# EAGLE design PR9013 (EAGLE 6.6.0)
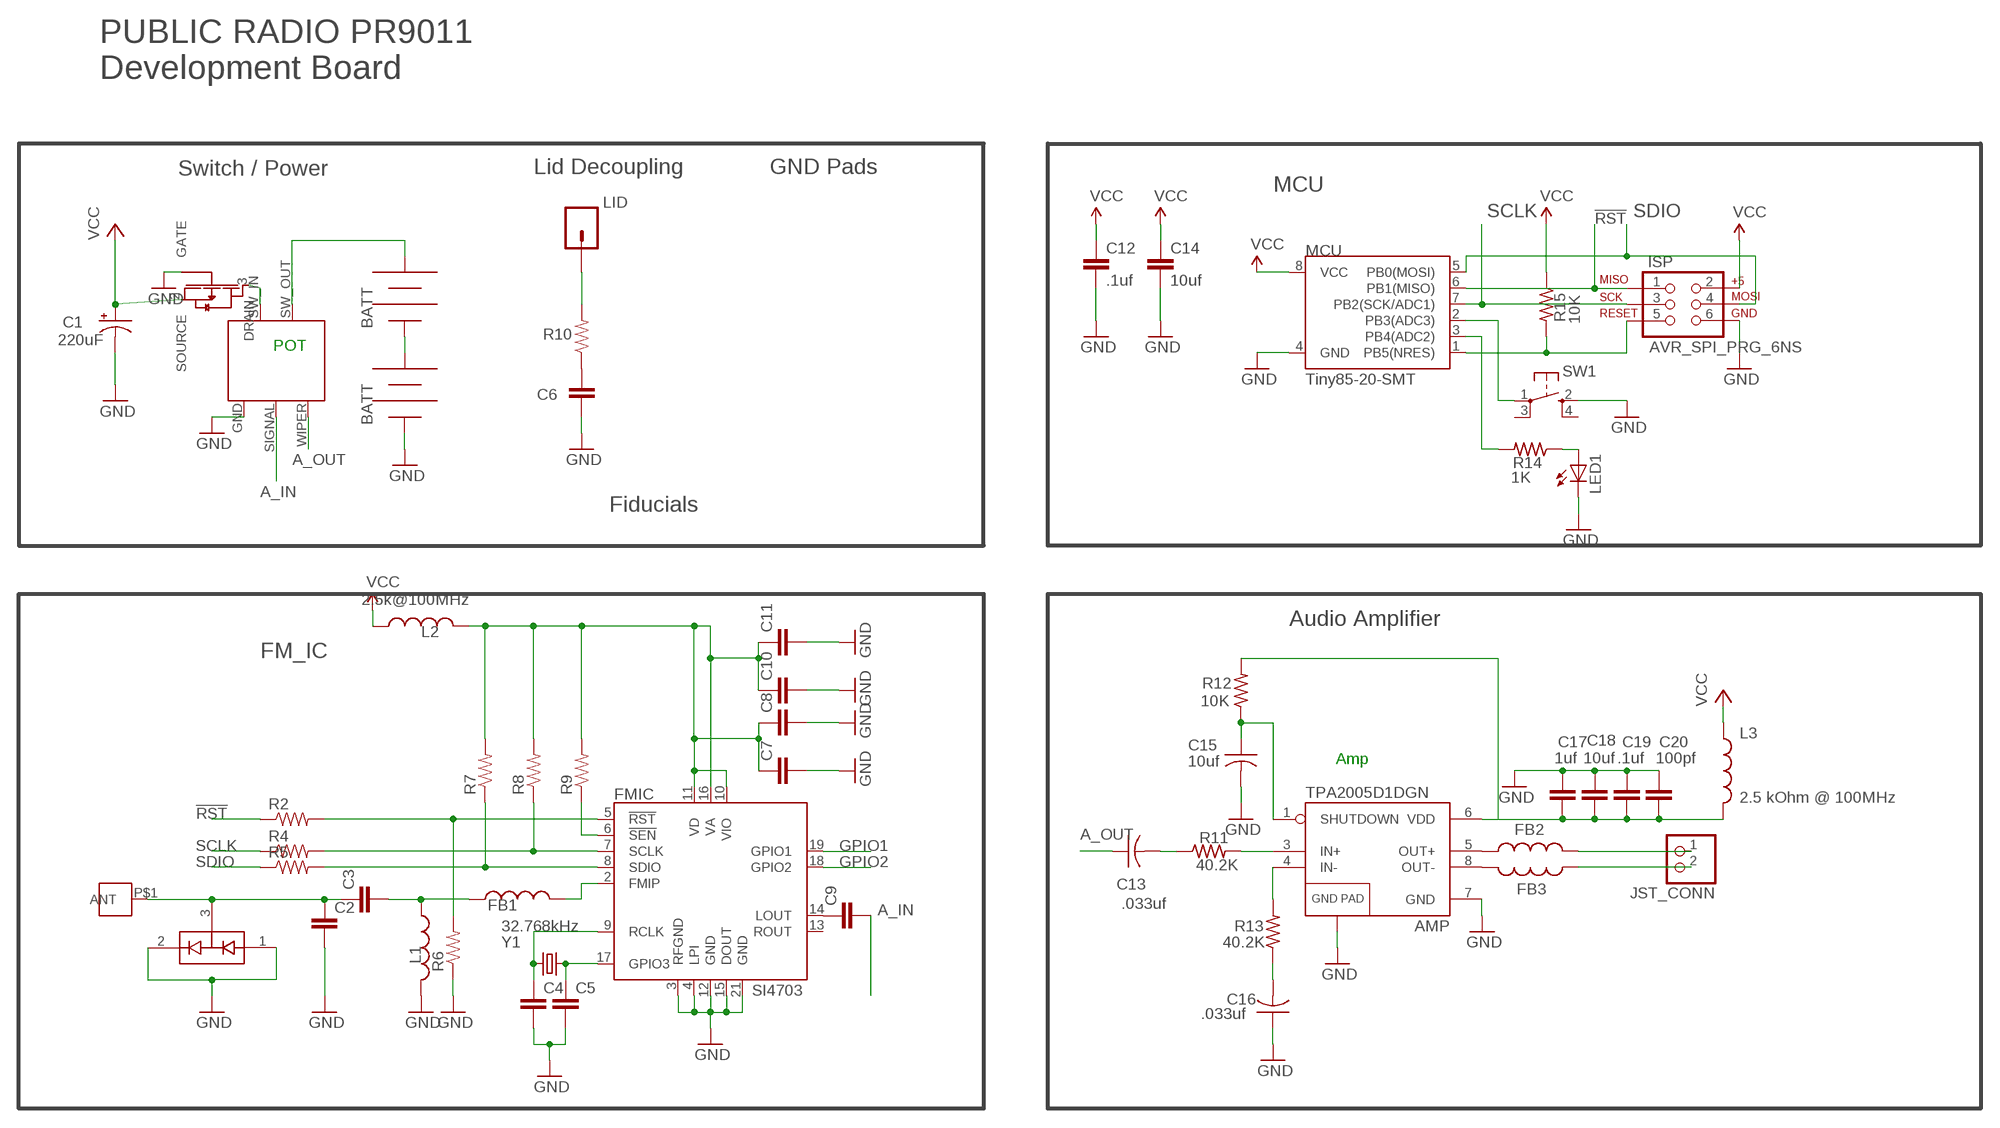
[diagram p0: schematic, sheet 1]

## Parts
AMP  TPA2005D1DGN  [POWER-SOP8]
C1  220uF  CAP_POLC  [PANASONIC_C]
C2  CAP0603-CAP  [0603-CAP]
C3  CAP0603-CAP  [0603-CAP]
C4  CAP0603-CAP  [0603-CAP]
C5  CAP0603-CAP  [0603-CAP]
C6  CAP0805  [0805]
C7  CAP0603-CAP  [0603-CAP]
C8  CAP0603-CAP  [0603-CAP]
C9  CAP0603-CAP  [0603-CAP]
C10  CAP0603-CAP  [0603-CAP]
C11  CAP0603-CAP  [0603-CAP]
C12  .1uf  CAP0805  [0805]
C13  .033uf  C-USC0603  [C0603]
C14  10uf  CAP0805  [0805]
C15  10uf  C-USC0603  [C0603]
C16  .033uf  C-USC0603  [C0603]
C17  1uf  CAP0805  [0805]
C18  10uf  CAP0805  [0805]
C19  .1uf  CAP0805  [0805]
C20  100pf  CAP0805  [0805]
D1  BAV99  [SOT23-3]
FB1  INDUCTOR0805  [0805]
FB2  INDUCTOR0805  [0805]
FB3  INDUCTOR0805  [0805]
FET1  SI2333DDS  [SI2333DDS]
FMIC  SI4703  SPARKFUN_SI470X  [SPARKFUN_SI470X]
ISP  AVR_SPI_PRG_6NS  [2X3-NS]
J1  M3_SCREW_POST  [M3_SCREW_POST]
JP5  BK-92_MPD_AA_BATT_CLIP  [BK-92_MPD_AA_BATT_CLIP]
JP6  BK-92_MPD_AA_BATT_CLIP  [BK-92_MPD_AA_BATT_CLIP]
JST_CONN  JST_2PIN-SMT-RA  [JST-PH-2-SMT-RA]
L1  INDUCTOR0805  [0805]
L2  2.5k@100MHz  INDUCTOR0603  [0603]
L3  2.5 kOhm @ 100MHz  INDUCTOR0603  [0603]
LED1  LEDSML0603  [SML0603]
LID  M01PTH  [1X01]
MCU  Tiny85-20-SMT  ATTINY45TINY85-20-SMT  [SO08-EIAJ]
R1  RV170SF_TAIWANA_POT_SW  [RV170SF_TAIWANA_POT_SW]
R2  RESISTOR0603-RES  [0603-RES]
R4  RESISTOR0603-RES  [0603-RES]
R5  RESISTOR0603-RES  [0603-RES]
R6  RESISTOR0603-RES  [0603-RES]
R7  RESISTOR0603-RES  [0603-RES]
R8  RESISTOR0603-RES  [0603-RES]
R9  RESISTOR0603-RES  [0603-RES]
R10  RESISTOR0805-RES  [0805]
R11  40.2K  R-US_R0603  [R0603]
R12  10K  R-US_R0603  [R0603]
R13  40.2K  R-US_R0603  [R0603]
R14  1K  R-US_R0603  [R0603]
R15  10K  R-US_R0603  [R0603]
SW1  SPST_TACT-KMR2  [KMR2]
Y1  32.768kHz  CRYSTAL32-SMD  [CRYSTAL-32KHZ-SMD]

## Nets
3.3V: C7.1 C8.1 C10.1 C11.1 FMIC.10(VIO) FMIC.11(VD) FMIC.16(VA) L2.2 R7.2 R8.2 R9.2
!RST: ISP.1 MCU.6(PB1(MISO)) R2.1
!RST-L: FMIC.5(!RST) R2.2 R6.2
!SEN-L: FMIC.6(!SEN) R9.1
A_IN: C9.2 R1.SIGNAL
A_OUT: C13.1 R1.WIPER
GND: AMP.7(GND) AMP.9(GND) C1.- C2.2 C4.2 C5.2 C6.2 C7.2 C8.2 C10.2 C11.2 C12.2 C14.2 C15.2 C16.1 C17.1 C18.1 C19.1 C20.1 D1.1(A1) D1.2(C2) FET1.1(GATE) FMIC.3(RFGND) FMIC.4(LPI) FMIC.12(GND) FMIC.15(DOUT) FMIC.21(GND) ISP.6 JP6.NEG JP6.NEG@2(NEG) L1.2 LED1.C MCU.4(GND) R1.GND R6.1 SW1.2(S)
GPIO1: FMIC.19(GPIO1)
GPIO2: FMIC.18(GPIO2)
N$1: C4.1 FMIC.9(RCLK) Y1.X2
N$2: C5.1 FMIC.17(GPIO3) Y1.X1
N$3: C13.2 R11.1
N$4: AMP.3(IN+) R11.2
N$5: AMP.4(IN-) R13.2
N$6: FB1.2 FMIC.2(FMIP)
N$7: LED1.A R14.1
N$8: LID.1 R10.2
N$9: FB2.2 JST_CONN.1
N$10: C9.1 FMIC.14(LOUT)
N$11: MCU.2(PB3(ADC3)) SW1.1(P)
N$12: MCU.3(PB4(ADC2)) R14.2
N$13: JP5.NEG JP5.NEG@2(NEG) JP6.POS JP6.POS@2(POS)
N$14 [antenna]: C2.1 C3.1 D1.3(COM) J1.P$1(ANT)
N$15: JP5.POS JP5.POS@2(POS) R1.SW_OUT
N$16 [antenna]: C3.2 FB1.1 L1.1
N$17: AMP.8(OUT-) FB3.2
N$18: AMP.6(VDD) C17.2 C18.2 C19.2 C20.2 L3.2 R12.2
N$19: AMP.5(OUT+) FB2.1
N$20: AMP.1(SHUTDOWN) C15.1 R12.1
N$23: C16.2 R13.1
N$34: FET1.3(DRAIN) R1.SW_IN
N$35: C6.1 R10.1
OUT-: FB3.1 JST_CONN.2
PB5: ISP.5 MCU.1(PB5(NRES)) R15.2
SCLK: ISP.3 MCU.7(PB2(SCK/ADC1)) R4.1
SCLK-L: FMIC.7(SCLK) R4.2 R8.1
SDIO: ISP.4 MCU.5(PB0(MOSI)) R5.1
SDIO-L: FMIC.8(SDIO) R5.2 R7.1
VCC: C1.+ C12.1 C14.1 FET1.2(SOURCE) ISP.2 L2.1 L3.1 MCU.8(VCC) R15.1
Unconnected: FMIC.13(ROUT) SW1.3(P1) SW1.4(S1)

## Notes on the sheet
- PUBLIC RADIO PR9011
  Development Board
- Switch / Power | Lid Decoupling | GND Pads
- MCU
- POT
- Fiducials
- Audio Amplifier
- FM_IC
- Amp

## Library data of the parts
AMP = SparkFun-AnalogIC:TPA2005D1: 1.4W MONO CLASS-D AUDIO POWER AMPLIFIER The TPA2005D1 is a 1.4-W high efficiency filter-free class-D audio power amplifier in a BGA, QFN, or MSOP package that requires only three external components. Datasheet: http://focus.ti.com/lit/ds/symlink/tpa2005d1.pdf 1.4 W Into 8 ? From a 5V Supply at THD = 10% (Typ) Maximum Battery Life and Minimum Heat Efficiency With an 8-? Speaker: 84% at 400 mW, 79% at 100 mW 2.8-mA Quiescent Current 0.5-mA Shutdown Current Ideal for Wireless or Cellular Handsets and PDAs Capable of Driving an 8-? Speaker (2.5 V ? VDD ? 5.5 V) and a 4-? Speaker (2.5 V ? VDD ? 4.2 V) Only Three External Components Optimized PWM Output Stage Eliminates LC Output Filter Internally Generated 250-kHz Switching Frequency Eliminates Capacitor and Resistor Improved PSRR (-71 dB at 217 Hz) and Wide Supply Voltage (2.5 V to 5.5 V) Eliminates Need for a Voltage Regulator Fully Differential Design Reduces RF Rectification and Eliminates Bypass Capacitor Improved CMRR Eliminates Two Input Coupling Capacitors
C1 = SparkFun-Passives:CAP_POL: Capacitor Polarized These are standard SMD and PTH capacitors. Normally 10uF, 47uF, and 100uF in electrolytic and tantalum varieties. Always verify the external diameter of the through hole cap, it varies with capacity, voltage, and manufacturer. The EIA devices should be standard.
C2-C12 C14 C17-C20 = SparkFun-Passives:CAP: Capacitor Standard 0603 ceramic capacitor, and 0.1" leaded capacitor.
C13 C15 C16 = resistor:C-US: CAPACITOR, American symbol
D1 = SparkFun-DiscreteSemi:BAV99: Two small signal silicon diodes connected anode to cathode. Connections to all three nodes available. DIO-10647; PROD_ID: DIO-10647
FB1-FB3 L1-L3 = SparkFun-Passives:INDUCTOR: Inductors Basic Inductor/Choke - 0603 and 1206. Footprints are not proven and vary greatly between part numbers. SRN6045- 33uH, 20% 1.4A SDR0403-560KL - 56uH, 10%, 500mA RMS/740mA peak
FET1 = PubRadioLib:SI2333DDS
FMIC = FM-Meter-Driver-v11:SPARKFUN_SI470X: Description: This is a powerful FM receiver IC. Tested with Si4703. You really only need SEN, RST, SCLK, and SDIO to get a full FM radio working. Antenna comes from headphone jack. See breakout board on SparkFun website for more information.
ISP = SparkFun-Connectors:AVR_SPI_PRG_6: AVR ISP 6 Pin This is the reduced ISP connector for AVR programming. Common on Arduino. This footprint will take up less PCB space and can be used with a 10-pin to 6-pin adapter such as SKU: BOB-08508 **Special note about "TEST_POINT" package. The stop mask is on the top side, so if you want your programming test points to be on the bottom of your board, make sure to place this package on the bottom side of the board. This also ensure that the orientation to program from the bottom side will be correct.
J1 = PR_Parts_Library:M3_SCREW_POST
JP5 JP6 = PR_Parts_Library:BK-92_MPD_AA_BATT_CLIP
JST_CONN = adafruit:JST_2PIN: JST 2-Pin Connectors of various flavors SMT-RA (S2B-PH-SM4) 4UConnector #17311 SMT (B2B-PH-SM4) THM-RA (S2B-PH) THM (B2B-PH)
LED1 = led:LED: LED OSRAM: - CHIPLED LG R971, LG N971, LY N971, LG Q971, LY Q971, LO R971, LY R971 LH N974, LH R974 LS Q976, LO Q976, LY Q976 LO Q996 - Hyper CHIPLED LW Q18S LB Q993, LB Q99A, LB R99A - SideLED LS A670, LO A670, LY A670, LG A670, LP A670 LB A673, LV A673, LT A673, LW A673 LH A674 LY A675 LS A676, LA A676, LO A676, LY A676, LW A676 LS A679, LY A679, LG A679 - Hyper Micro SIDELED® LS Y876, LA Y876, LO Y876, LY Y876 LT Y87S - SmartLED LW L88C, LW L88S LB L89C, LB L89S, LG L890 LS L89K, LO L89K, LY L89K LS L896, LA L896, LO L896, LY L896 - TOPLED LS T670, LO T670, LY T670, LG T670, LP T670 LSG T670, LSP T670, LSY T670, LOP T670, LYG T670 LG T671, LOG T671, LSG T671 LB T673, LV T673, LT T673, LW T673 LH T674 LS T676, LA T676, LO T676, LY T676, LB T676, LH T676, LSB T676, LW T676 LB T67C, LV T67C, LT T67C, LS T67K, LO T67K, LY T67K, LW E67C LS E67B, LA E67B, LO E67B, LY E67B, LB E67C, LV E67C, LT E67C LW T67C LS T679, LY T679, LG T679 LS T770, LO T770, LY T770, LG T770, LP T770 LB T773, LV T773, LT T773, LW T773 LH T774 LS E675, LA E675, LY E675, LS T675 LS T776, LA T776, LO T776, LY T776, LB T776 LHGB T686 LT T68C, LB T68C - Hyper Mini TOPLED® LB M676 - Mini TOPLED Santana® LG M470 LS M47K, LO M47K, LY M47K Source: http://www.osram.convergy.de LUXEON: - LUMILED® LXK2-PW12-R00, LXK2-PW12-S00, LXK2-PW14-U00, LXK2-PW14-V00 LXK2-PM12-R00, LXK2-PM12-S00, LXK2-PM14-U00 LXK2-PE12-Q00, LXK2-PE12-R00, LXK2-PE12-S00, LXK2-PE14-T00, LXK2-PE14-U00 LXK2-PB12-K00, LXK2-PB12-L00, LXK2-PB12-M00, LXK2-PB14-N00, LXK2-PB14-P00, LXK2-PB14-Q00 LXK2-PR12-L00, LXK2-PR12-M00, LXK2-PR14-Q00, LXK2-PR14-R00 LXK2-PD12-Q00, LXK2-PD12-R00, LXK2-PD12-S00 LXK2-PH12-R00, LXK2-PH12-S00 LXK2-PL12-P00, LXK2-PL12-Q00, LXK2-PL12-R00 Source: www.luxeon.com KINGBRIGHT: KA-3528ASYC Source: www.kingbright.com
LID = SparkFun-Connectors:M01: Header 1 Standard 1-pin 0.1" header. Use with straight break away headers (SKU : PRT-00116), right angle break away headers (PRT-00553), swiss pins (PRT-00743), machine pins (PRT-00117), and female headers (PRT-00115).
MCU = SparkFun-DigitalIC:ATTINY45: Atmel 8-pin 2/4/8kB flash uC; PROD_ID: IC-09092
R1 = PR_Parts_Library:RV170SF_TAIWANA_POT_SW
R2 R4-R10 = SparkFun-Passives:RESISTOR: Resistor Basic schematic elements and footprints for 0603, 1206, and PTH resistors.
R11-R15 = resistor:R-US_: RESISTOR, American symbol
SW1 = adafruit:SPST_TACT: SMT 6mm switch, EVQQ2 series http://www.ladyada.net/library/eagle
Y1 = SparkFun:CRYSTAL: Crystals Various standard crystals. Proven footprints. Spark Fun Electronics SKU : COM-00534

## Net classes
1 antenna: clearance 1.27 mm

## Board
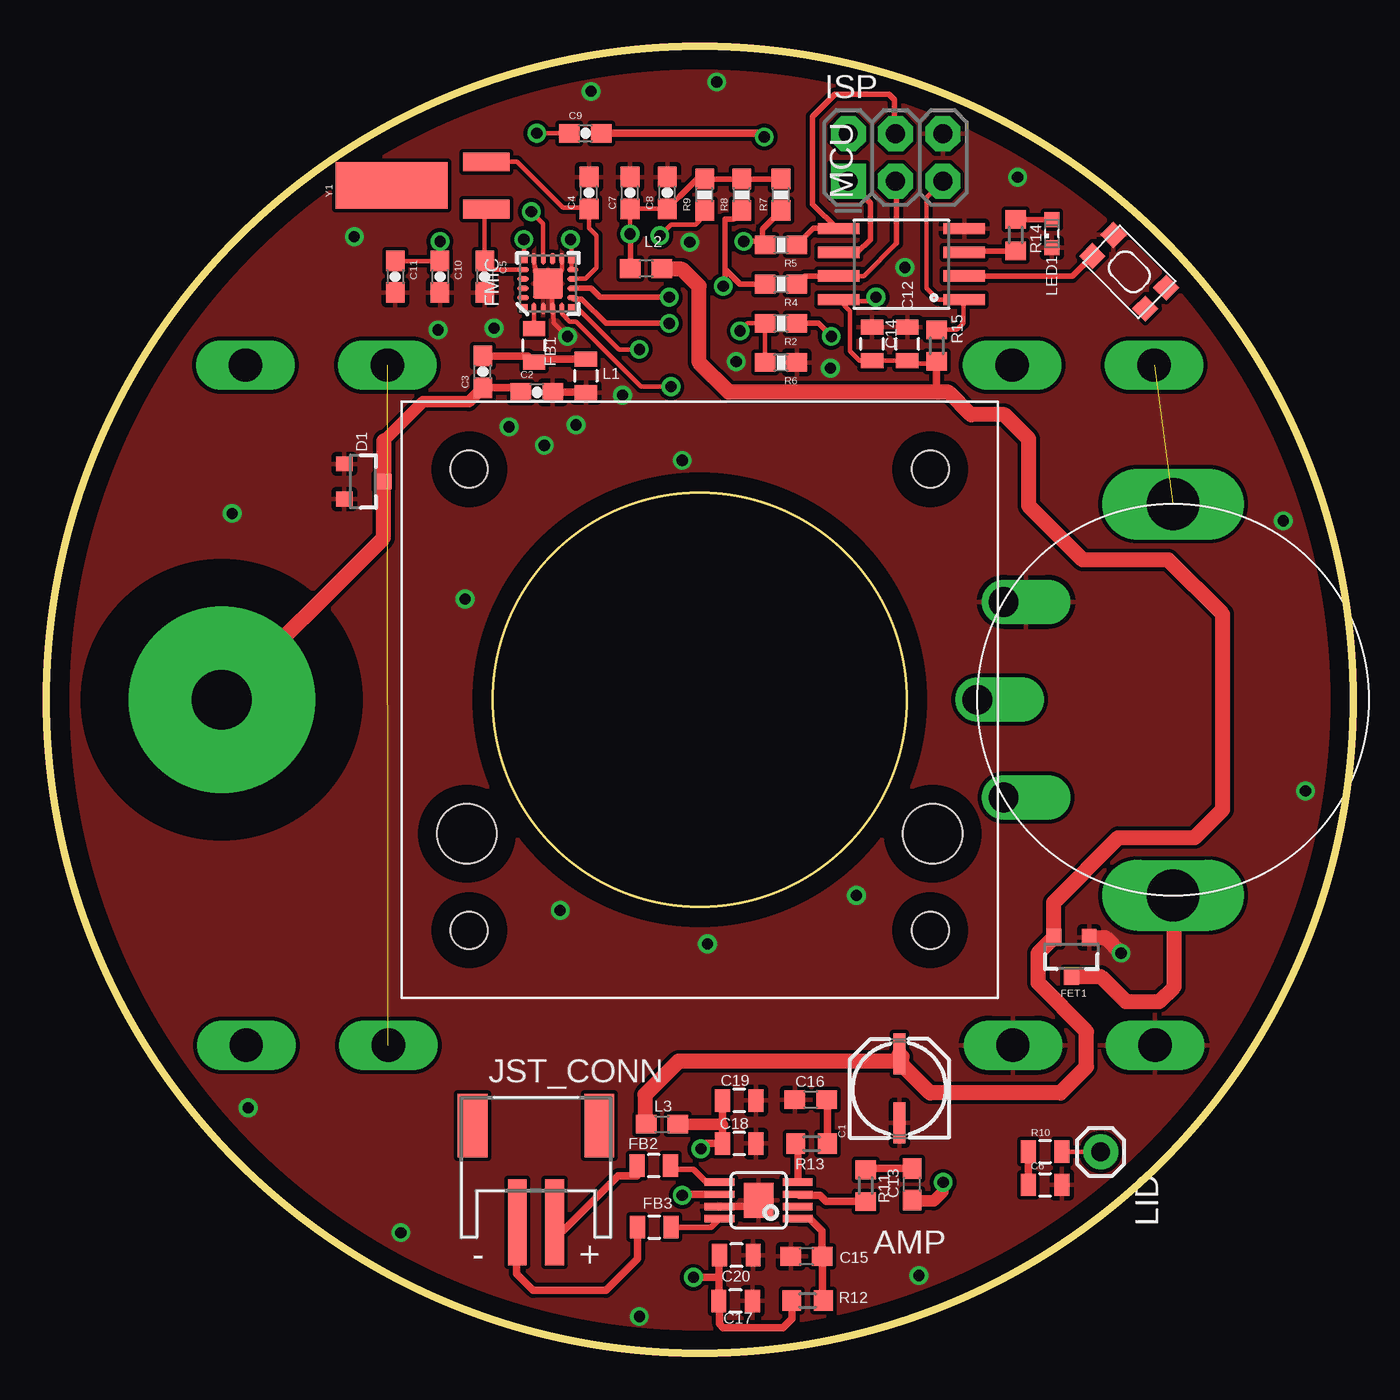
[diagram p1: board, top side]
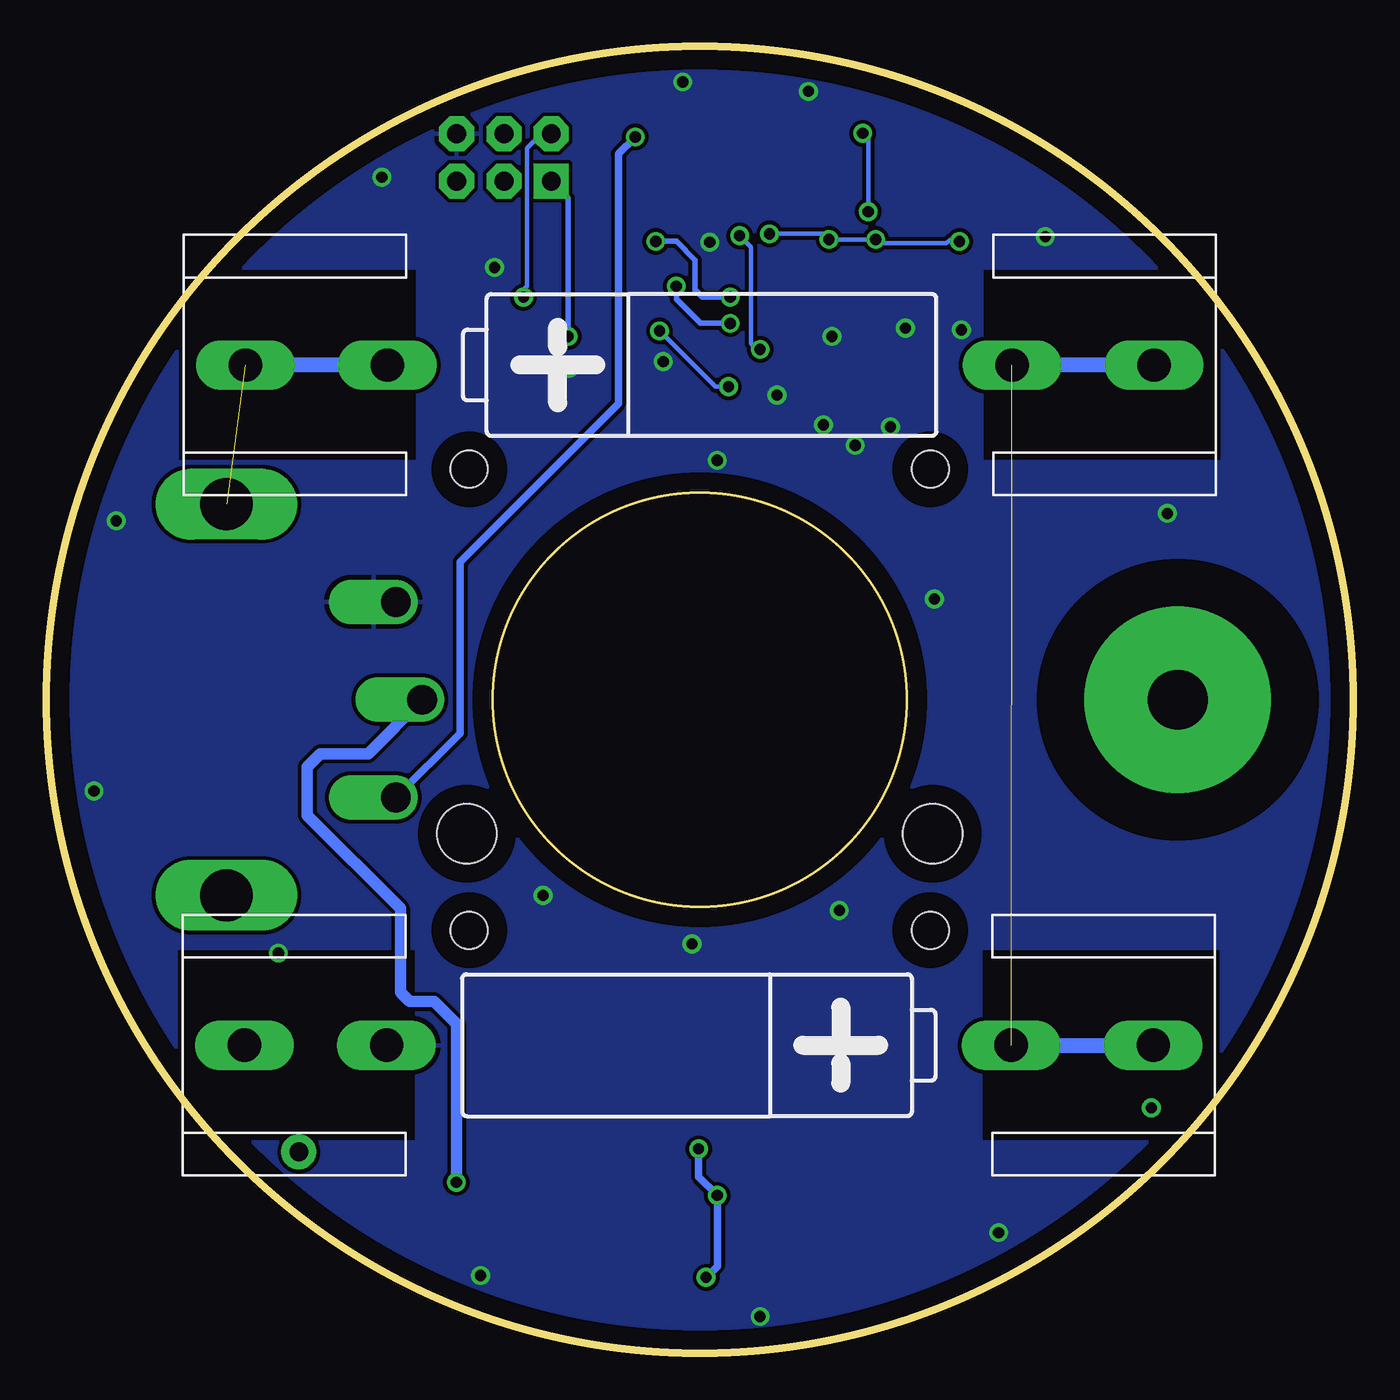
[diagram p2: board, bottom side, seen from below]

Size 70.11 x 70.11 mm. Coordinates in mm from the lower left corner, seen from the top.
Outline: circle at 35.05,35.05 radius 35.05
Copper layers (1*16): Top 0.035mm / dielectric 1.5mm / Bottom 0.035mm
Design rules "default *": minimum track width 10mil, minimum drill 0.6mm, track to track 8mil, track to pad 8mil, pad to pad 8mil, via to via 8mil, smd to smd 8mil, copper to edge 40mil, drill to drill 8mil, minimum pad ring 10mil, minimum via ring 8mil, stop-mask expansion 4mil, vias tented up to drill 0mil, thermal gap 10mil

### Footprints (pad centres in the part's own frame; a part is rotated, then mirrored left to right if it is on the bottom)
POWER-SOP8 = smd 0.4 x 1.6: 1 -0.975,-2.1; 2 -0.325,-2.1; 3 0.325,-2.1; 4 0.975,-2.1; 5 0.975,2.1; 6 0.325,2.1; 7 -0.325,2.1; 8 -0.975,2.1 | smd 1.89 x 1.57: 9 0,0
PANASONIC_C = smd 2.2 x 0.65: + 1.9,-0.2; - -1.8,-0.2
0603-CAP = smd 1.1 x 1: 1 -0.85,0; 2 0.85,0
0805 = smd 0.8 x 1.2: 1 -0.9,0; 2 0.9,0
C0603 = smd 1.1 x 1: 1 -0.85,0; 2 0.85,0
SOT23-3 = smd 0.8 x 0.9: 1 -0.95,-1; 2 0.95,-1; 3 0,1.1
SI2333DDS = smd 0.8 x 0.9: 1 -0.95,-1; 2 0.95,-1; 3 0,1.1
SPARKFUN_SI470X = smd 0.34 x 0.34: 1 -1.275,1.265; 6 -1.265,-1.265; 11 1.265,-1.265; 16 1.265,1.265 | smd 0.61 x 0.28: 2 -1.335,0.75; 3 -1.335,0.25; 4 -1.335,-0.25; 5 -1.335,-0.75; 12 1.335,-0.75; 13 1.335,-0.25; 14 1.335,0.25; 15 1.335,0.75 | smd 0.28 x 0.61: 7 -0.75,-1.335; 8 -0.25,-1.335; 9 0.25,-1.335; 10 0.75,-1.335; 17 0.75,1.335; 18 0.25,1.335; 19 -0.25,1.335; 20 -0.75,1.335 | smd 1.6 x 1.6: 21 0,0
2X3-NS = drill 1.016 pad 1.88 square: 1 -2.54,-1.27 | drill 1.016 pad 1.88 octagon: 2 -2.54,1.27; 3 0,-1.27; 4 0,1.27; 5 2.54,-1.27; 6 2.54,1.27
M3_SCREW_POST = drill 3.2 pad 10: P$1 0,0
BK-92_MPD_AA_BATT_CLIP = drill 1.778 long: NEG -24.384,0; NEG@2 -16.764,0; POS 16.764,0; POS@2 24.384,0
JST-PH-2-SMT-RA = smd 1 x 4.6: 1 1,-3.7; 2 -1,-3.7 | smd 1.6 x 3.4: NC1 -3.4,1.5; NC2 3.4,1.5
0603 = smd 1.1 x 1: 1 -0.85,0; 2 0.85,0
SML0603 = smd 0.8 x 0.8: A 0.75,0; C -0.75,0
1X01 = drill 1.016 pad 1.88: 1 0,0
SO08-EIAJ = smd 0.61 x 2.21: 1 -1.905,-3.378; 2 -0.635,-3.378; 3 0.635,-3.378; 4 1.905,-3.378; 5 1.905,3.353; 6 0.635,3.353; 7 -0.635,3.353; 8 -1.905,3.353
RV170SF_TAIWANA_POT_SW = drill 1.6 offset: GND -5.25,-9.09; SIGNAL 5.25,-9.09; WIPER 0,-10.5 | drill 2.8 long: SW_IN 10.5,0; SW_OUT -10.5,0
0603-RES = smd 1.1 x 1: 1 -0.85,0; 2 0.85,0
R0603 = smd 1 x 1.1: 1 -0.85,0; 2 0.85,0
CE32A_FOR_JST = hole 2: -12.37,12.37; 12.37,12.37; 12.37,-12.37; -12.37,-12.37 | hole 3.2: -12.497,-7.188; 12.497,-7.188
KMR2 = smd 1 x 1: 1 2,0.8; 2 2,-0.8; 3 -2,0.8; 4 -2,-0.8
CRYSTAL-32KHZ-SMD = smd 2.5 x 6: SHEILD 0,5.08 | smd 1 x 2.5: X1 -1.27,0; X2 1.27,0

### Placement (x,y rotation side)
AMP  38.21,8.18 90 top
C1  45.56,14.14 90 top
C2  26.31,51.55 0 top
C3  23.41,52.65 90 top
C4  29.11,62.25 90 top
C5  23.51,57.75 270 top
C6  53.58,9.02 0 top
C7  31.31,62.25 90 top
C8  33.31,62.25 90 top
C9  28.91,65.45 0 top
C10  21.11,57.75 270 top
C11  18.71,57.75 270 top
C12  46.19,54.15 90 top
C13  46.45,9.04 90 top
C14  44.3,54.15 90 top
C15  40.78,5.18 180 top
C16  41,13.59 0 top
C17  36.97,2.78 180 top
C18  37.18,11.23 180 top
C19  37.18,13.54 180 top
C20  37.02,5.24 180 top
D1  16.98,46.76 270 top
FB1  26.16,54.07 90 top
FB2  32.58,10.05 180 top
FB3  32.61,6.75 0 top
FET1  55,21.3 180 top
FMIC  26.9,57.38 90 top
ISP  45.56,64.15 0 top
J1  9.4,35.05 0 top
JP5  35.05,53.01 180 bottom
JP6  35.1,16.51 0 bottom
JST_CONN  26.26,10.7 0 top
L1  28.94,52.44 270 top
L2  32.18,58.19 180 top
L3  33.03,12.27 0 top
LED1  53.95,60.06 90 top
LID  56.57,10.78 270 top
MCU  45.86,58.43 90 top
R1  60.45,35.05 270 top
R2  39.41,55.25 180 top
R4  39.41,57.35 180 top
R5  39.41,59.45 180 top
R6  39.41,53.15 180 top
R7  39.41,62.15 90 top
R8  37.31,62.15 90 top
R9  35.31,62.15 90 top
R10  53.58,10.81 0 top
R11  43.95,8.98 270 top
R12  40.84,2.81 180 top
R13  41.05,11.23 180 top
R14  52,59.99 270 top
R15  47.76,54.05 90 top
SPEAKER  CE32A_FOR_JST  [CE32A_FOR_JST]  35.05,35.05 0 top
SW1  58.1,58.02 135 top
Y1  23.6,62.65 90 top

### Tracks (layer width: path | path; a pad name or v marks a point on that pad's centre or on a via)
3.3V  (via drill 0.6)
  Top 0.254: FMIC.10 28.17,58.2 FMIC.11 28.17,59.7 v28.11,59.75 | C11.1 C10.1 v21.11,59.65 | v25.61,59.75 25.61,58.67 FMIC.16 | v31.31,60.05 C7.1 C8.1 33.96,62.05
  Top 0.305: L2.2 31.33,60.04 v31.31,60.05 | R7.2 R8.2 R9.2 34.91,63 33.96,62.05
  Bottom 0.254: v21.11,59.65 21.21,59.75 21.61,59.75 21.81,59.55 25.41,59.55 v25.61,59.75 v28.11,59.75 28.41,60.05 v31.31,60.05
!RST  (via drill 0.6)
  Top 0.305: MCU.6 43.52,59.06 44.21,59.75 44.21,61.69 ISP.1 | R2.1 41.41,55.25 v42.11,54.55
  Top 0.406: MCU.6
  Bottom 0.305: v42.11,54.55 42.11,61.98 ISP.1
!RST-L  (via drill 0.6)
  Top 0.254: FMIC.5 27.65,55.76 28.06,55.35 28.41,55.35 31.91,51.85 v33.51,51.85 | R6.2 R2.2 37.61,55.25 v37.21,54.85
  Bottom 0.254: v37.21,54.85 34.21,51.85 v33.51,51.85
!SEN-L  (via drill 0.6)
  Top 0.254: R9.1 35.31,61.05 34.81,60.55 33.51,60.55 v32.91,59.95 | v31.81,53.85 30.71,53.85 28.45,56.12 FMIC.6
  Bottom 0.254: v32.91,59.95 32.31,59.35 32.31,54.15 32.01,53.85 v31.81,53.85
A_IN  (via drill 0.6)
  Top 0.406: C9.2 38.31,65.45 v38.51,65.25
  Bottom 0.406: v38.51,65.25 39.41,64.35 39.41,50.95 47.91,42.45 47.91,33.25 R1.SIGNAL
A_OUT  (via drill 0.6)
  Top 0.61: v48.11,9.15 48.11,8.65 47.61,8.15 46.49,8.15 C13.1
  Bottom 0.61: R1.WIPER 52.85,32.15 55.41,32.15 56.11,31.45 56.11,28.85 51.11,23.85 51.11,19.35 50.61,18.85 49.31,18.85 48.11,17.65 v48.11,9.15
GND  (via drill 0.6)
  Top 0.254: 27.51,57.95 arc-54 26.91,57.4 26.76,57.4 26.41,57.75 arc-30 FMIC.15 | FMIC.12 27.65,58.13 FMIC.21 27.1,56.9 FMIC.4 27.15,56.01 27.21,55.95 27.21,55.3 v27.96,54.55
  Top 0.406: L1.2 28.92,51.55 C2.2 | AMP.7 37.89,7.86 AMP.9
  Top 0.813: FET1.1 56.82,22.3 v57.66,21.45
  other vias: 46.81,4.15 34.11,47.9 9.96,45.05 29.21,67.7 22.46,40.45 35.96,68.2 66.36,44.65 46.06,58.25 42.06,52.85 30.91,51.4 28.41,49.8 24.01,55 24.81,49.7 21.01,54.9 26.71,48.7 16.51,59.9 52.11,63.1 67.56,30.15 43.46,24.55 31.81,1.95 19.01,6.45 10.81,13.15 27.56,23.75 35.46,21.95 37.01,53.2 34.51,59.6
  pour Top: -0.09,35.75 -0.09,35.15 arc90 35.31,-0.25 35.41,-0.25 arc90 70.31,34.65 70.31,35.35 arc90 35.31,70.35 34.91,70.35 arc90
  pour Bottom: -0.09,35.75 -0.09,35.15 arc90 35.31,-0.25 35.41,-0.25 arc90 70.31,34.65 70.31,35.35 arc90 34.91,70.35 arc90
N$1
  Top 0.254: FMIC.9 28.26,57.65 28.91,57.65 29.51,58.25 29.51,59.95 29.11,60.35 C4.1 29.06,61.45 27.71,61.45 25.24,63.92 Y1.X2
N$2
  Top 0.254: FMIC.17 23.98,58.13 C5.1 23.51,61.09 Y1.X1
N$3
  Top 0.406: C13.2 44.02,9.89 R11.1
N$4
  Top 0.406: R11.2 41.84,8.13 41.51,8.45 40.37,8.45 AMP.3
N$5
  Top 0.406: AMP.4 40.31,11.12 R13.2
N$6
  Top 0.254: 26.16,56.04 FMIC.2 26.15,54.98 FB1.2
N$7
  Top 0.305: LED1.A 52.02,60.81 R14.1
N$8
  Top 0.254: R10.2 54.5,10.78 LID.1
N$9
  Top 0.305: FB2.2 31.68,9.52 | 27.71,6.55 JST_CONN.1
  Top 0.406: 31.68,9.52 30.68,9.52 27.71,6.55
N$10  (via drill 0.6)
  Top 0.254: FMIC.14 26.65,60.61 v26.01,61.25 | v26.31,65.45 C9.1
  Bottom 0.254: v26.01,61.25 26.01,65.15 v26.31,65.45
N$11
  Top 0.254: MCU.2 48.27,57.79
  Top 0.305: MCU.2 55.05,57.79 SW1.1
N$12
  Top 0.254: MCU.3 49.27,59.09
  Top 0.305: R14.2 49.32,59.14 MCU.3
N$13  (1 unrouted)
  Bottom 0.813: JP6.POS JP6.POS@2 | JP5.NEG JP5.NEG@2
N$14
  Top 0.406: 9.38,35.07 arc-90 J1.P$1 | C2.1 25.21,51.8 C3.1
  Top 0.61: C3.1 22.66,51.05 20.21,51.05 18.11,48.95
  Top 0.813: J1.P$1 18.08,43.73 D1.3 18.11,46.8 18.11,48.95
N$15  (1 unrouted)
  Bottom 0.813: JP5.POS JP5.POS@2
N$16
  Top 0.406: C3.2 25.83,53.5 FB1.1 26.33,53.34 L1.1
N$17
  Top 0.305: FB3.2 35.66,6.75 AMP.8
N$18  (via drill 0.6)
  Top 0.406: C19.2 36.28,12.25 C18.2 35.39,11.23 v35.11,10.95 | R12.2 39.99,1.83 39.51,1.35 36.31,1.35 36.11,1.55 36.11,2.74 C17.2 36.07,3.95 | 36.07,3.95 36.07,5.19 C20.2 | AMP.6 34.17,8.51 v34.11,8.45 | v34.71,4.05 35.97,4.05 36.07,3.95
  Top 0.61: L3.2 36.26,12.27 36.28,12.25
  Bottom 0.406: v34.71,4.05 34.11,4.65 v34.11,8.45 35.11,9.45 v35.11,10.95
N$19
  Top 0.305: AMP.5 35.41,9.16 34.71,9.85 33.68,9.85 FB2.1
N$20
  Top 0.406: AMP.1 40.96,7.21 41.61,6.55 41.61,5.2 C15.1 41.63,2.87 R12.1
N$23
  Top 0.406: R13.1 41.9,13.54 C16.2
N$34
  Top 0.813: FET1.3 56.57,20.2 57.91,18.85 59.71,18.85 60.51,19.65 60.51,24.49 R1.SW_IN
N$35
  Top 0.406: R10.1 C6.1
OUT-
  Top 0.406: FB3.1 31.71,5.05 30.01,3.35 26.11,3.35 25.21,4.25 25.21,6.95 JST_CONN.2
PB5
  Top 0.254: R15.2 48.86,54.9 49.21,55.25 49.21,56.49 MCU.1 47.84,56.52 47.21,57.15 47.21,62 ISP.5
SCLK
  Top 0.254: MCU.7 43.85,57.79 45.61,59.55
  Top 0.305: MCU.7 40.7,57.79 R4.1 | 45.61,59.55 45.61,62.83 ISP.3
SCLK-L  (via drill 0.6)
  Top 0.305: R4.2 37.21,57.35 36.41,58.15 | 37.11,61.1 R8.1 36.86,60.85 36.41,60.85 36.41,58.15 | 36.41,58.15 36.41,57.35 v36.31,57.25 | v33.41,55.25 30.01,55.25 28.71,56.55 28.32,56.55 FMIC.7
  Bottom 0.305: v36.31,57.25 36.31,56.55 35.01,55.25 v33.41,55.25
SDIO
  Top 0.254: 42.49,60.35 MCU.5
  Top 0.305: 42.49,60.35 41.16,60.35 R5.1 | MCU.5 42.43,60.33 41.11,61.65 41.11,66.35 42.31,67.55 45.21,67.55 45.51,67.25 45.51,65.47 ISP.4
SDIO-L  (via drill 0.6)
  Top 0.305: R5.2 38.56,59.5 38.41,59.65 | 38.41,59.65 38.41,60.3 R7.1 | 38.41,59.65 v37.41,59.65 | v33.41,56.65 29.71,56.65 29.21,57.15 28.26,57.15 FMIC.8
  Bottom 0.305: v37.41,59.65 36.31,59.65 35.31,58.65 35.31,57.05 34.91,56.65 v33.41,56.65
VCC  (via drill 0.6)
  Top 0.254: MCU.8 | 47.74,53.1 46.34,53.1 C12.1 C14.1 43.61,53.25 43.11,53.75 43.11,55.92 MCU.8 | v44.51,56.65 44.31,56.45 42.58,56.45 MCU.8
  Top 0.406: 47.81,51.55 47.76,51.6 R15.1 47.74,53.1
  Top 0.813: L2.1 33.06,58.15 34.11,58.15 35.01,57.25 35.01,53.15 36.61,51.55 47.81,51.55 48.41,51.55 49.61,50.35 51.41,50.35 52.71,49.05 52.71,45.45 55.61,42.55 60.21,42.55 63.11,39.65 63.11,29.15 61.61,27.65 57.51,27.65 54.05,24.19 FET1.2 53.21,21.46 53.21,19.85 55.81,17.25 55.81,15.35 54.41,13.95 47.41,13.95 45.91,15.45 | 45.91,15.45 45.71,15.65 33.91,15.65 32.11,13.85 32.11,12.34 L3.1 | 45.91,15.45 45.91,15.89 C1.+
  Bottom 0.254: ISP.2 43.54,65.42 44.31,64.65 44.31,57.25 44.51,57.05 v44.51,56.65